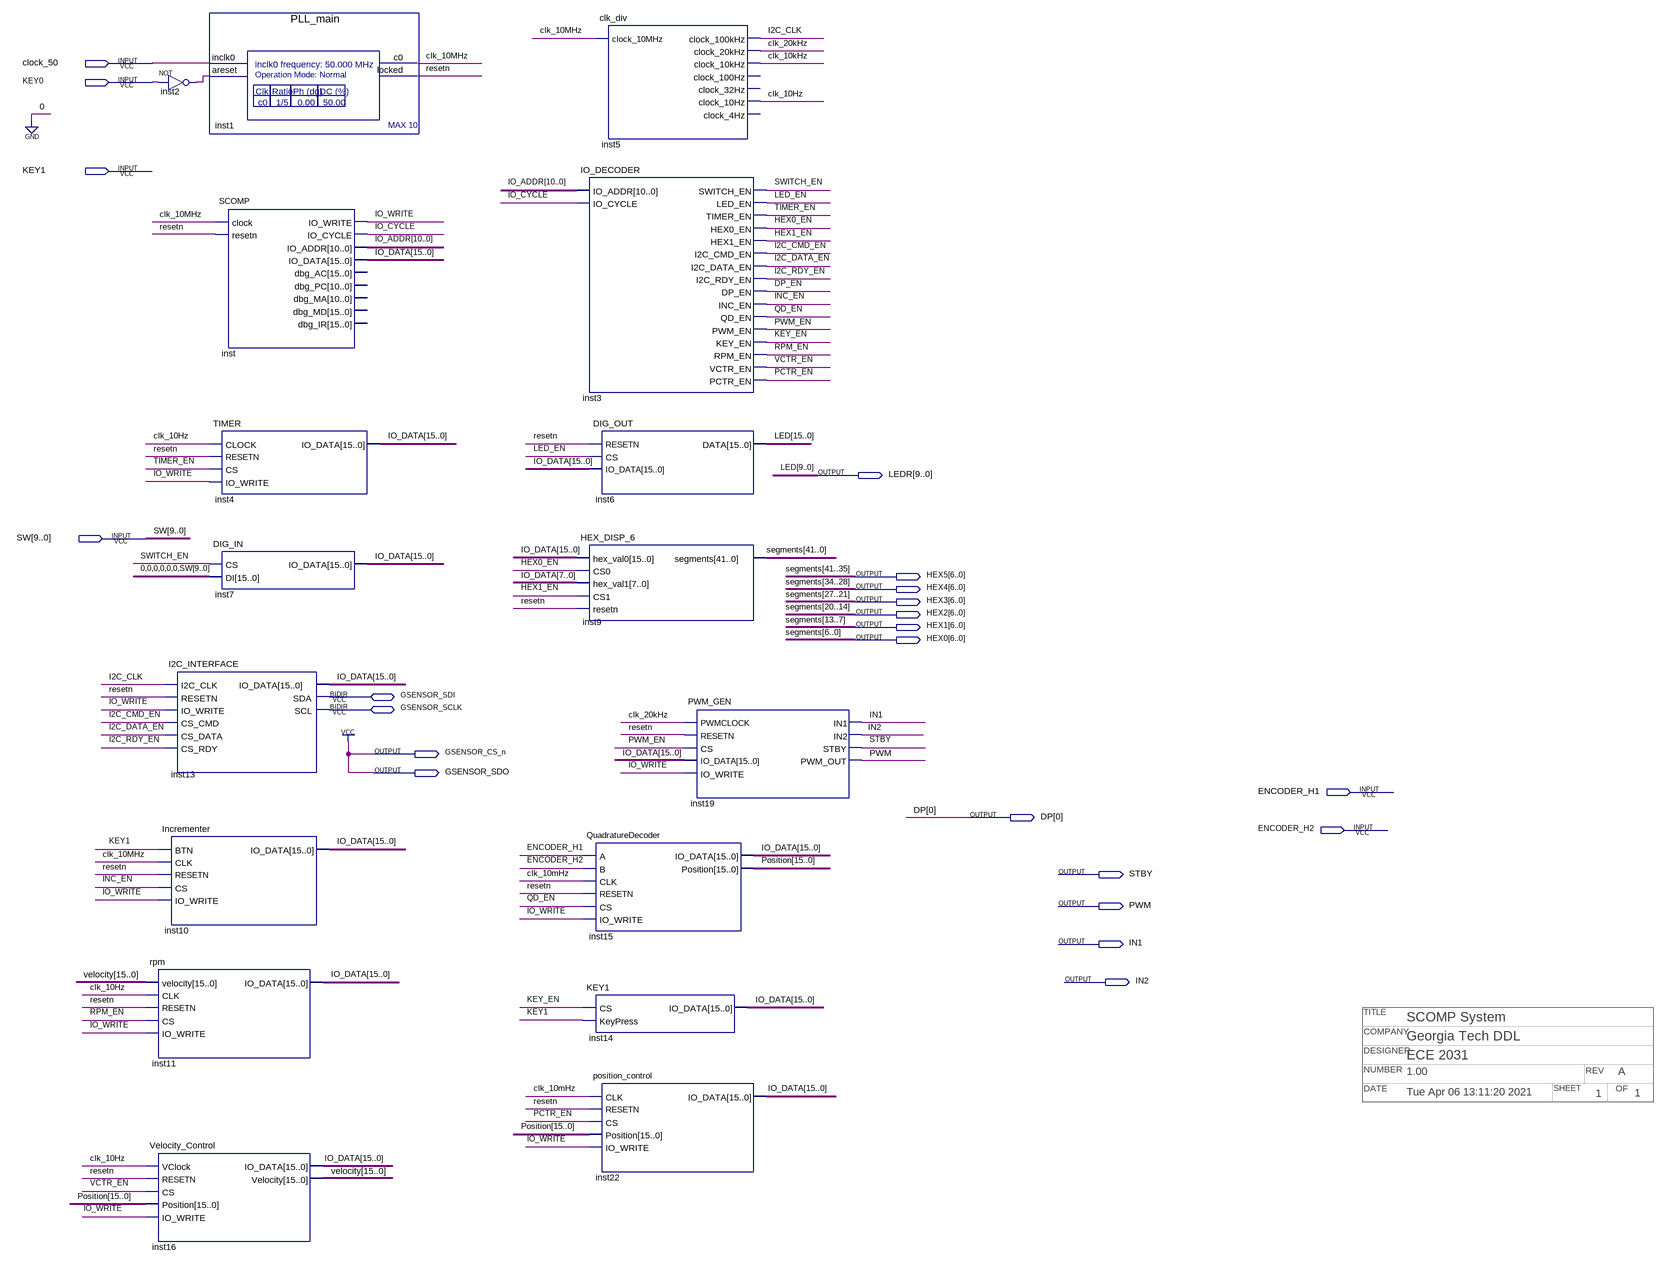
[diagram p0: schematic sheet]
// Quartus schematic SCOMP_System.bdf as structural Verilog: 17 symbols, 22 pins
// Title block: COMPANY: Georgia Tech DDL; DATE: Tue Apr 06 13:11:20 2021; DESIGNER: ECE 2031; NUMBER: 1.00; OF: 1; REV: A; SHEET: 1; TITLE: SCOMP System
module SCOMP_System (
  input  clock_50,
  input  KEY0,
  input  KEY1,
  input  [9:0] SW,
  input  ENCODER_H1,
  input  ENCODER_H2,
  inout  GSENSOR_SDI,
  inout  GSENSOR_SCLK,
  output [9:0] LEDR,
  output [6:0] HEX5,
  output [6:0] HEX4,
  output [6:0] HEX3,
  output [6:0] HEX2,
  output [6:0] HEX1,
  output [6:0] HEX0,
  output GSENSOR_CS_n,
  output GSENSOR_SDO,
  output [0:0] DP,
  output STBY,
  output PWM,
  output IN1,
  output IN2
);

  wire clk_10Hz, clk_10kHz, clk_10MHz, clk_20kHz, DP_EN, HEX0_EN, HEX1_EN, I2C_CLK, I2C_CMD_EN, I2C_DATA_EN,
       I2C_RDY_EN, INC_EN, inst2_out, IO_CYCLE, IO_WRITE, KEY_EN, LED_EN, PCTR_EN, PWM_EN, QD_EN, resetn,
       RPM_EN, SWITCH_EN, TIMER_EN, VCTR_EN;
  wire [10:0] IO_ADDR;
  wire [15:0] IO_DATA, Position, velocity;
  wire [15:10] LED;

  not inst2 (inst2_out, KEY0);
  Incrementer inst10 (
    .BTN(KEY1), .CLK(clk_10MHz), .RESETN(resetn), .CS(INC_EN), .IO_WRITE(IO_WRITE), .IO_DATA(IO_DATA));
  rpm inst11 (
    .velocity(velocity), .CLK(clk_10Hz), .RESETN(resetn), .CS(RPM_EN), .IO_WRITE(IO_WRITE), .IO_DATA(IO_DATA));
  Velocity_Control inst16 (
    .VClock(clk_10Hz), .RESETN(resetn), .CS(VCTR_EN), .Position(Position), .IO_WRITE(IO_WRITE),
    .IO_DATA(IO_DATA), .Velocity(velocity));
  PLL_main inst1 (.inclk0(clock_50), .areset(inst2_out), .c0(clk_10MHz), .locked(resetn));
  TIMER inst4 (.CLOCK(clk_10Hz), .RESETN(resetn), .CS(TIMER_EN), .IO_WRITE(IO_WRITE), .IO_DATA(IO_DATA));
  DIG_IN inst7 (.CS(SWITCH_EN), .DI({{6{1'b0}}, SW}), .IO_DATA(IO_DATA));
  I2C_INTERFACE inst13 (
    .I2C_CLK(I2C_CLK), .RESETN(resetn), .IO_WRITE(IO_WRITE), .CS_CMD(I2C_CMD_EN), .CS_DATA(I2C_DATA_EN),
    .CS_RDY(I2C_RDY_EN), .IO_DATA(IO_DATA), .SDA(GSENSOR_SDI), .SCL(GSENSOR_SCLK));
  SCOMP inst (
    .clock(clk_10MHz), .resetn(resetn), .IO_WRITE(IO_WRITE), .IO_CYCLE(IO_CYCLE), .IO_ADDR(IO_ADDR),
    .IO_DATA(IO_DATA));  // open: dbg_AC, dbg_PC, dbg_MA, dbg_MD, dbg_IR
  clk_div inst5 (
    .clock_10MHz(clk_10MHz), .clock_100kHz(I2C_CLK), .clock_20kHz(clk_20kHz), .clock_10kHz(clk_10kHz),
    .clock_10Hz(clk_10Hz));  // open: clock_100Hz, clock_32Hz, clock_4Hz
  IO_DECODER inst3 (
    .IO_ADDR(IO_ADDR), .IO_CYCLE(IO_CYCLE), .SWITCH_EN(SWITCH_EN), .LED_EN(LED_EN), .TIMER_EN(TIMER_EN),
    .HEX0_EN(HEX0_EN), .HEX1_EN(HEX1_EN), .I2C_CMD_EN(I2C_CMD_EN), .I2C_DATA_EN(I2C_DATA_EN),
    .I2C_RDY_EN(I2C_RDY_EN), .DP_EN(DP_EN), .INC_EN(INC_EN), .QD_EN(QD_EN), .PWM_EN(PWM_EN), .KEY_EN(KEY_EN),
    .RPM_EN(RPM_EN), .VCTR_EN(VCTR_EN), .PCTR_EN(PCTR_EN));
  DIG_OUT inst6 (.RESETN(resetn), .CS(LED_EN), .IO_DATA(IO_DATA), .DATA({LED, LEDR}));
  HEX_DISP_6 inst9 (
    .hex_val0(IO_DATA), .CS0(HEX0_EN), .hex_val1(IO_DATA[7:0]), .CS1(HEX1_EN), .resetn(resetn),
    .segments({HEX5, HEX4, HEX3, HEX2, HEX1, HEX0}));
  QuadratureDecoder inst15 (
    .A(ENCODER_H1), .B(ENCODER_H2), .CLK(clk_10MHz), .RESETN(resetn), .CS(QD_EN), .IO_WRITE(IO_WRITE),
    .IO_DATA(IO_DATA), .Position(Position));
  KEY1 inst14 (.CS(KEY_EN), .KeyPress(KEY1), .IO_DATA(IO_DATA));
  position_control inst22 (
    .CLK(clk_10MHz), .RESETN(resetn), .CS(PCTR_EN), .Position(Position), .IO_WRITE(IO_WRITE),
    .IO_DATA(IO_DATA));
  PWM_GEN inst19 (
    .PWMCLOCK(clk_20kHz), .RESETN(resetn), .CS(PWM_EN), .IO_DATA(IO_DATA), .IO_WRITE(IO_WRITE), .IN1(IN1),
    .IN2(IN2), .STBY(STBY), .PWM_OUT(PWM));

  assign GSENSOR_CS_n = 1'b1;
  assign GSENSOR_SDO = 1'b1;

  // Other names for the same wires on the sheet: LED[9:0] = LEDR;
  //   segments[41:0] = {HEX5, HEX4, HEX3, HEX2, HEX1, HEX0}
endmodule
